# Altium schematic sheet Shield_Connectors.SchDoc: =SheetTitle_Top
size 420 x 297 mm; Author: G.Kasprowicz; CompanyName: WUT ISE; DrawnBy: G.Kasprowicz; Organization: WUT ISE; Address1: PW ISE; Address2: Nowowiejska 15/19 00-665 Warsaw; Address3: gkasprow@gmail.com; ModifiedBy: -; CheckedDate: -; Title2: SPEC-A7 / GPSDO connectors; DivGrp: WUT ISE; Designer: G.Kasprowicz; ModifiedDate: -; ProjectName: Sensor Box
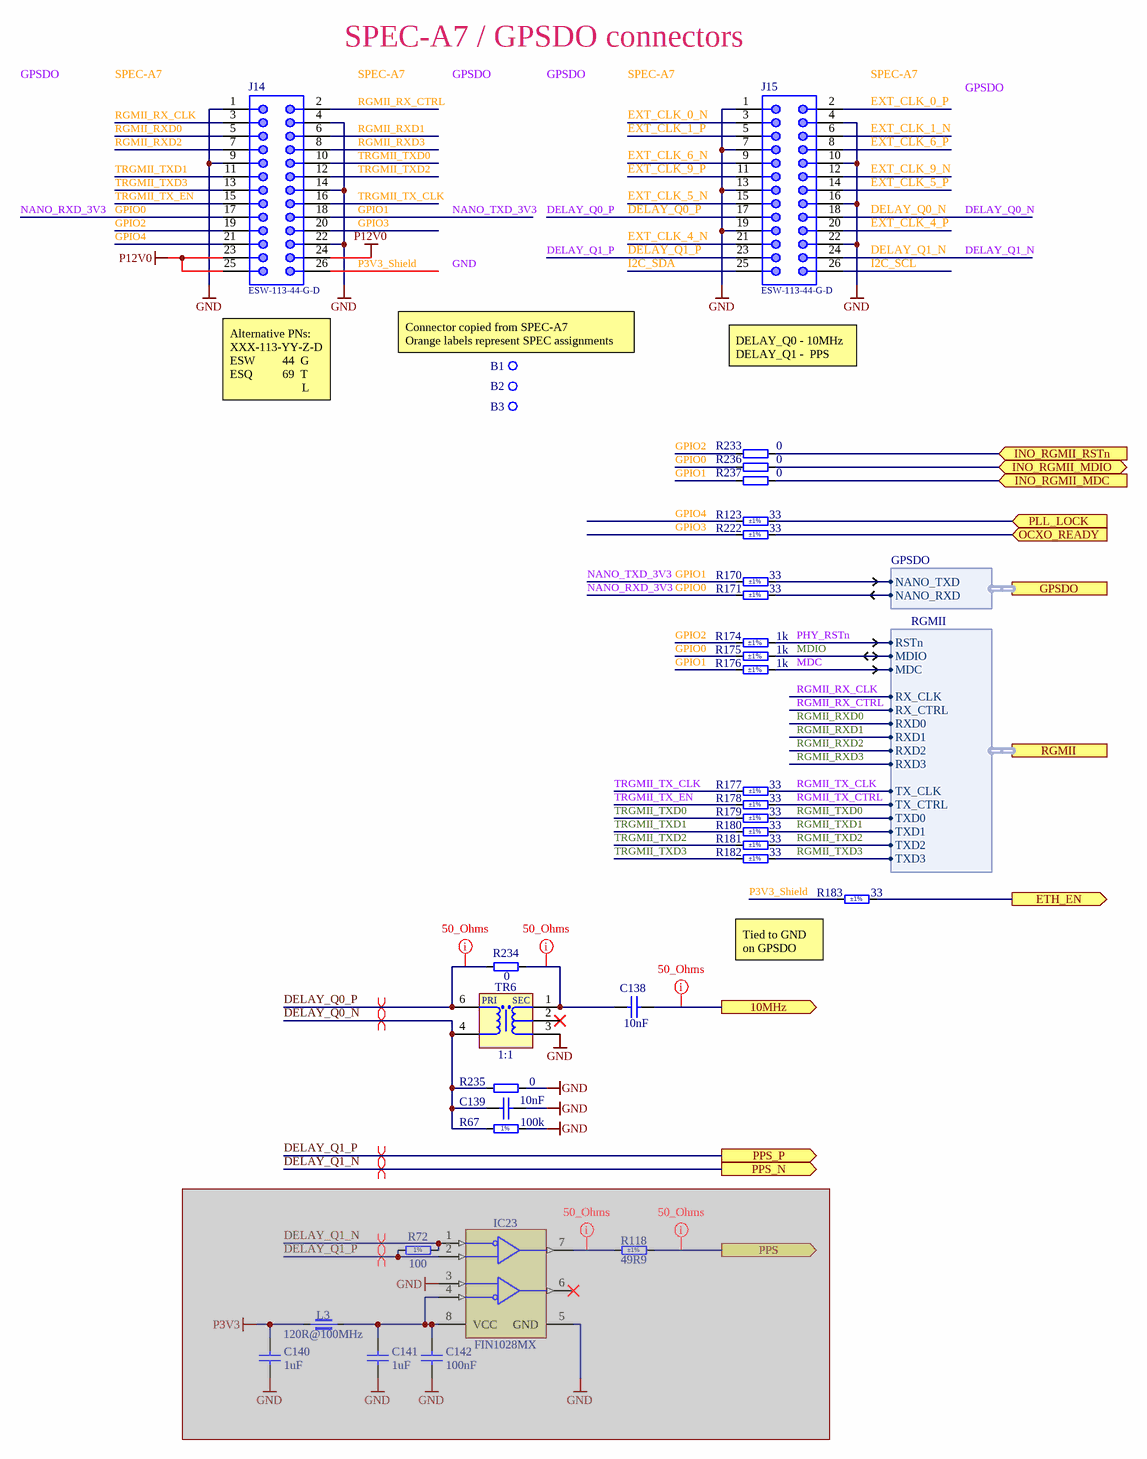
[diagram p0: Shield_Connectors.SchDoc]

## Parts
B1  Non Plated Hole  [MTG400]  (value not drawn)  (no BOM)
B2  Non Plated Hole  [MTG400]  (value not drawn)  (no BOM)
B3  Non Plated Hole  [MTG400]  (value not drawn)  (no BOM)
C138  10nF  [CAPC1005X55N]
C139  10nF  [CAPC1005X55N]
C140  1uF  [CAPC1608X87N]  (masked out: inside a compile mask, not in the netlist)
C141  1uF  [CAPC1608X87N]  (masked out: inside a compile mask, not in the netlist)
C142  100nF  [CAPC1005X55N]  (masked out: inside a compile mask, not in the netlist)
IC23  FIN1028MX  [SOIC127P600X175-8N]  (masked out: inside a compile mask, not in the netlist)
J14  ESW-113-44-G-D  [ESW-113-44-G-D]
J15  ESW-113-44-G-D  [ESW-113-44-G-D]
L3  120R@100MHz  [INDC1608X65N]  (masked out: inside a compile mask, not in the netlist)
R67  100k  [RESC1005X40N]
R72  100  [RESC1005X40N]  (masked out: inside a compile mask, not in the netlist)
R118  49R9  Tolerance: ±1%  [RESC1005X40N]  (masked out: inside a compile mask, not in the netlist)
R123  33  Tolerance: ±1%  [RESC1005X40N]
R170  33  Tolerance: ±1%  [RESC1005X40N]
R171  33  Tolerance: ±1%  [RESC1005X40N]
R174  1k  Tolerance: ±1%  [RESC1005X40N]
R175  1k  Tolerance: ±1%  [RESC1005X40N]
R176  1k  Tolerance: ±1%  [RESC1005X40N]
R177  33  Tolerance: ±1%  [RESC1005X40N]
R178  33  Tolerance: ±1%  [RESC1005X40N]
R179  33  Tolerance: ±1%  [RESC1005X40N]
R180  33  Tolerance: ±1%  [RESC1005X40N]
R181  33  Tolerance: ±1%  [RESC1005X40N]
R182  33  Tolerance: ±1%  [RESC1005X40N]
R183  33  Tolerance: ±1%  [RESC1005X40N]
R222  33  Tolerance: ±1%  [RESC1005X40N]
R233  0  [RESC1005X40N]
R234  0  [RESC1005X40N]
R235  0  [RESC1608X55N]
R236  0  [RESC1005X40N]
R237  0  [RESC1005X40N]
TR6  1:1  [XFMR_MINI-CIRCUITS_AT1521]

## Ports
10MHz (out), ETH_EN (out), GPSDO (harness GPSDO), INO_RGMII_MDC (in), INO_RGMII_MDIO (bidir), INO_RGMII_RSTn (in), OCXO_READY (in), PLL_LOCK (in), PPS (out), PPS_N (out), PPS_P (out), RGMII (harness RGMII)

## Harnesses
RGMII: RSTn, MDIO, MDC, RX_CLK, RX_CTRL, RXD0, RXD1, RXD2, RXD3, TXD0, TXD1, TXD2, TXD3, TX_CTRL, TX_CLK
GPSDO: NANO_RXD, NANO_TXD

## Nets
GND: C139.1 J14.1 J14.4 J14.9 J14.14 J14.22 J15.1 J15.4 J15.7 J15.10 J15.13 J15.16 J15.19 J15.22 R67.2 R235.1 TR6.3(S)
P12V0: J14.23 J14.24 J14.25
10MHz: C138.1 ; port 10MHz
DELAY_Q0_N: C139.2 J15.18 R67.1 R235.2 TR6.4(P)
DELAY_Q0_P: J15.17 R234.1 TR6.6(PDOT)
DELAY_Q1_N: J15.24 ; port PPS_N
DELAY_Q1_P: J15.23 ; port PPS_P
ETH_EN: R183.2 ; port ETH_EN
EXT_CLK_0_N: J15.3
EXT_CLK_0_P: J15.2
EXT_CLK_1_N: J15.6
EXT_CLK_1_P: J15.5
EXT_CLK_4_N: J15.21
EXT_CLK_4_P: J15.20
EXT_CLK_5_N: J15.15
EXT_CLK_5_P: J15.14
EXT_CLK_6_N: J15.9
EXT_CLK_6_P: J15.8
EXT_CLK_9_N: J15.12
EXT_CLK_9_P: J15.11
GPIO0: J14.17 R171.1 R175.1 R236.2
GPIO1: J14.18 R170.1 R176.1 R237.2
GPIO2: J14.19 R174.1 R233.2
GPIO3: J14.20 R222.1
GPIO4: J14.21 R123.1
I2C_SCL: J15.26
I2C_SDA: J15.25
INO_RGMII_MDC: R237.1 ; port INO_RGMII_MDC
INO_RGMII_MDIO: R236.1 ; port INO_RGMII_MDIO
INO_RGMII_RSTn: R233.1 ; port INO_RGMII_RSTn
MDC: R176.2 ; port RGMII.MDC
MDIO: R175.2 ; port RGMII.MDIO
OCXO_READY: R222.2 ; port OCXO_READY
P3V3_Shield: J14.26 R183.1
PHY_RSTn: R174.2 ; port RGMII.RSTn
PLL_LOCK: R123.2 ; port PLL_LOCK
RGMII_RX_CLK: J14.3 ; port RGMII.RX_CLK
RGMII_RX_CTRL: J14.2 ; port RGMII.RX_CTRL
RGMII_RXD0: J14.5 ; port RGMII.RXD0
RGMII_RXD1: J14.6 ; port RGMII.RXD1
RGMII_RXD2: J14.7 ; port RGMII.RXD2
RGMII_RXD3: J14.8 ; port RGMII.RXD3
RGMII_TX_CLK: R177.2 ; port RGMII.TX_CLK
RGMII_TX_CTRL: R178.2 ; port RGMII.TX_CTRL
RGMII_TXD0: R179.2 ; port RGMII.TXD0
RGMII_TXD1: R180.2 ; port RGMII.TXD1
RGMII_TXD2: R181.2 ; port RGMII.TXD2
RGMII_TXD3: R182.2 ; port RGMII.TXD3
TRGMII_TX_CLK: J14.16 R177.1
TRGMII_TX_EN: J14.15 R178.1
TRGMII_TXD0: J14.10 R179.1
TRGMII_TXD1: J14.11 R180.1
TRGMII_TXD2: J14.12 R181.1
TRGMII_TXD3: J14.13 R182.1
NetC138_2: C138.2 R234.2 TR6.1(SDOT)
NetR170_2: R170.2 ; port GPSDO.NANO_TXD
NetR171_2: R171.2 ; port GPSDO.NANO_RXD

Not connected (* = marked no-connect by the designer): B1 1; B2 1; B3 1; TR6 2(NC)*

## Layout directives
net class 50_Ohms: 10MHz, (no net found under the mark), DELAY_Q0_P, NetC138_2
differential pair: (no net found under the mark), DELAY_Q0_N, DELAY_Q0_P, DELAY_Q1_N, DELAY_Q1_P

## Notes on the sheet
- SPEC-A7 / GPSDO connectors
- GPSDO
- SPEC-A7
- NANO_RXD_3V3
- NANO_TXD_3V3
- DELAY_Q0_P
- DELAY_Q0_N
- GND
- DELAY_Q1_P
- DELAY_Q1_N
- (near B1) Connector copied from SPEC-A7
  Orange labels represent SPEC assignments
- DELAY_Q0 - 10MHz
  DELAY_Q1 -  PPS
- (near J14) Alternative PNs:
  XXX-113-YY-Z-D
  ESW         44  G
  ESQ          69  T
  L
- (near R183) Tied to GND on GPSDO
- Project/Equipment
- Document
- Designer
- Drawn by
- Check.by
- Copyright WUT ISE 2020.
  This documentation describes Open Hardware and is licensed under the CERN OHL v.1.2. You may redistribute and modify this documentation under the terms of the CERN OHL v.1.2. (http://ohwr.org/CERNOHL). This documentation is distributed WITHOUT ANY EXPRESS OR IMPLIED WARRANTY, INCLUDING OF MERCHANTABILITY, SATISFACTORY QUALITY AND FITNESS FOR A PARTICULAR PURPOSE. Please see the CERN OHL v.1.2 for applicable conditions.
- Contact
- File
- Last Mod.
- Print Date
- Sheet
- Size
- A3
- of
- Rev
- (in symbol R0402_100K_1%_0.0625W_100PPM) 1%
- (in symbol R0402_100R_1%_0.0625W_100PPM) 1%
- (in symbol XFMR_MINI-CIRCUITS_TC2-1TX+) PRI; SEC

## Library data of the parts
B1-B3 = NON-PLATED_HOLE4.0: Single Terminal Socket; Part Description: Non Plated Through Hole: Hole Dia.=4.0mm; Mounted: No; Part Number: NON-PLATED_HOLE4.0; Component Type: Standard (No BOM); Pin Count: 1; Family: Non Plated Hole; Socket: No; SMD: No; Sense: No; Status: None; ComponentHeight: 0mm; HelpURL: Undefined; Author: CERN DEM JMW; CreateDate: 22.03.2019; LatestRevisionDate: 22.03.2019; PackageDescription: Non Plated Through Hole: Hole Dia.=4.0mm
C138 C139 = CC0402_10NF_16V_10%_X7R: Non-polarised capacitor; Part Description: SMD Multilayer Chip Ceramic Capacitor; Manufacturer: GENERIC; Manufacturer1 Part Number: 223878715636; Voltage: 16V; TC: X7R; Tolerance: ±10%; Part Number: CC0402_10NF_16V_10%_X7R; Component Kind: Standard; Component Type: Standard; Pin Count: 2; Value: 10nF; Status: Not Recommended; Manufacturer Part Number: CC0402_10NF_16V_10%_X7R; Case: 0402; Mounted: Yes; Socket: No; SMD: Yes; Sense: No; Manufacturer1 Example: PHYCOMP; Manufacturer1 ComponentHeight: 0.55mm; HelpURL: \\cern.ch\dfs\Applications\Altium\Datasheets\CC0402_X7R_PHYCOMP.pdf; Author: CERN DEM JLC; CreateDate: 2007-12-03; LatestRevisionDate: 2007-12-03
C140 C141 = CC0603_1UF_25V_10%_X7R: Non-polarised capacitor; Part Description: SMD Multilayer Chip Ceramic Capacitor; Manufacturer: GENERIC; Manufacturer1 Part Number: GRM188R71E105KA12D; Voltage: 25V; TC: X7R; Tolerance: ±10%; Part Number: CC0603_1UF_25V_10%_X7R; Component Kind: Standard; Component Type: Standard; Pin Count: 2; Value: 1uF; Status: None; Manufacturer Part Number: CC0603_1UF_25V_10%_X7R; Case: 0603; Mounted: Yes; Socket: No; SMD: Yes; Sense: No; Manufacturer1 Example: MURATA; Manufacturer1 ComponentHeight: 0.9mm; HelpURL: \\cern.ch\dfs\Applications\Altium\Datasheets\CC0603_X7R_MURATA.pdf; Author: CERN DEM JLC; CreateDate: 18.01.2011; LatestRevisionDate: 18.01.2011
C142 = CC0402_100NF_16V_10%_X5R: Non-polarised capacitor; Part Description: SMD Multilayer Chip Ceramic Capacitor; Manufacturer: GENERIC; Manufacturer1 Part Number: GRM155R61C104KA88D; Voltage: 16V; TC: X5R; Tolerance: ±10%; Part Number: CC0402_100NF_16V_10%_X5R; Component Kind: Standard; Component Type: Standard; Pin Count: 2; Value: 100nF; Status: None; Manufacturer Part Number: CC0402_100NF_16V_10%_X5R; Case: 0402; Mounted: Yes; Socket: No; SMD: Yes; Sense: No; Manufacturer1 Example: MURATA; Manufacturer1 ComponentHeight: 0.55mm; HelpURL: \\cern.ch\dfs\Applications\Altium\Datasheets\CC0402_X5R_MURATA_GRM.pdf; Author: CERN DEM JLC; CreateDate: 10.12.2013; LatestRevisionDate: 10.12.2013
IC23 = IFC_FIN1028: 3.3V LVDS 2-Bit High-Speed Differential Reciever; Manufacturer: ON Semiconductor; PressFit: No; Bonding: No; Part Number: FIN1028MX; Component Kind: Standard; Component Type: Standard; Device: FIN1028MX; PackageDescription: SOIC 8, Pitch 1.27mm - Body 4x5mm, IPC Medium Density; Part Description: 3.3V LVDS 2-Bit High-Speed Differential Reciever; Manufacturer Part Number: FIN1028MX; Pin Count: 8; Case: SOIC8; Mounted: Yes; Socket: No; SMD: Yes; Sense: No; ComponentHeight: 0.8mm; Author: GK; HelpURL: \\cern.ch\dfs\Applications\Altium\Datasheets\FIN1101K8X.pdf; CreateDate: 08/11/2016; LatestRevisionDate: 08/11/2016
J14 J15 = ESW-113-44-G-D: ESW-113-44-G-D Pin Header, THT, pitch 2.54mm, Dual Row, Vertical, 26pin; Manufacturer: Samtec; Pin Number: 26; Part Number: ESW-113-44-G-D; Publisher: Samtec; Pitch: 2.54mm; Mounting Technology: THT; Manufacturer Part Number: ESW-113-44-G-D
L3 = IND0603_MURATA_BLM18SG121TN1D: Part Description: SMD EMIFIL Suppression Chip Ferrite Bead; Manufacturer: MURATA; Power: 3A; Resistance: 0.025R; Tolerance: ±25%; Part Number: IND0603_MURATA_BLM18SG121TN1D; Component Kind: Standard; Component Type: Standard; Pin Count: 2; Value: 120R@100MHz; Manufacturer Part Number: BLM18SG121TN1D; Case: 0603; Mounted: Yes; Socket: No; SMD: Yes; Sense: No; ComponentHeight: 0.65mm; HelpURL: \\cern.ch\dfs\Applications\Altium\Datasheets\IND0603_MURATA_BLM18S.pdf; Author: CERN DEM JLC; CreateDate: 23.07.2014; LatestRevisionDate: 25.10.2018
R67 = R0402_100K_1%_0.0625W_100PPM: Resistor - 1%; Part Description: General Purpose Thick Film Chip Resistor; Manufacturer: GENERIC; Manufacturer1 Part Number: 232270671004L; PressFit: No; TC: ±100ppm/°C; Part Number: R0402_100K_1%_0.0625W_100PPM; Component Kind: Standard; Component Type: Standard; Pin Count: 2; Value: 100k; Status: Not Recommended; Manufacturer Part Number: R0402_100K_1%_0.0625W_100PPM; Case: 0402; Mounted: Yes; Sense: No; Socket: No; SMD: Yes; Manufacturer1 Example: YAGEO PHYCOMP; Manufacturer1 ComponentHeight: 0.4mm; HelpURL: \\cern.ch\dfs\Applications\Altium\Datasheets\R0402_Phycomp_RC0402.pdf; Author: CERN DEM JLC; CreateDate: 03.12.2007; LatestRevisionDate: 17.10.2012; Power: 0.0625W; Tolerance: ±1%
R72 = R0402_100R_1%_0.0625W_100PPM: Resistor - 1%; Part Description: General Purpose Thick Film Chip Resistor; Manufacturer: GENERIC; Manufacturer1 Part Number: 232270671001L; TC: ±100ppm/°C; PressFit: No; Part Number: R0402_100R_1%_0.0625W_100PPM; Component Kind: Standard; Component Type: Standard; Pin Count: 2; Value: 100; Status: Not Recommended; Power: 0.0625W; Tolerance: ±1%; Manufacturer Part Number: R0402_100R_1%_0.0625W_100PPM; Case: 0402; Mounted: Yes; Sense: No; Socket: No; SMD: Yes; Manufacturer1 Example: YAGEO PHYCOMP; Manufacturer1 ComponentHeight: 0.4mm; HelpURL: \\cern.ch\dfs\Applications\Altium\Datasheets\R0402_Phycomp_RC0402.pdf; Author: CERN DEM JLC; CreateDate: 03.12.2007; LatestRevisionDate: 17.10.2012
R118 = R0402_49R9_1%_0.0625W_100PPM: Resistor - 1%; Part Description: General Purpose Thick Film Chip Resistor; Manufacturer: GENERIC; Manufacturer1 Part Number: 232270674999L or RC0402FR-0749R9L; TC: ±100ppm/°C; PressFit: No; Part Number: R0402_49R9_1%_0.0625W_100PPM; Component Kind: Standard; Component Type: Standard; Pin Count: 2; Value: 49R9; Status: Not Recommended; Power: 0.0625W; Manufacturer Part Number: R0402_49R9_1%_0.0625W_100PPM; Case: 0402; Mounted: Yes; Sense: No; Socket: No; SMD: Yes; Manufacturer1 Example: YAGEO PHYCOMP; Manufacturer1 ComponentHeight: 0.4mm; HelpURL: \\cern.ch\dfs\Applications\Altium\Datasheets\R0402_Phycomp_RC0402.pdf; Author: CERN DEM JLC; CreateDate: 24.10.2012; LatestRevisionDate: 24.10.2012
R123 R170 R171 R177-R183 R222 = R0402_33R_1%_0.0625W_100PPM: Resistor - 1%; Part Description: General Purpose Thick Film Chip Resistor; Manufacturer: GENERIC; Manufacturer1 Part Number: 232270673309L; TC: ±100ppm/°C; PressFit: No; Part Number: R0402_33R_1%_0.0625W_100PPM; Component Kind: Standard; Component Type: Standard; Pin Count: 2; Value: 33; Status: Not Recommended; Power: 0.0625W; Manufacturer Part Number: R0402_33R_1%_0.0625W_100PPM; Case: 0402; Mounted: Yes; Sense: No; Socket: No; SMD: Yes; Manufacturer1 Example: YAGEO PHYCOMP; Manufacturer1 ComponentHeight: 0.4mm; HelpURL: \\cern.ch\dfs\Applications\Altium\Datasheets\R0402_Phycomp_RC0402.pdf; Author: CERN DEM JLC; CreateDate: 03.12.2007; LatestRevisionDate: 17.10.2012
R174-R176 = R0402_1K_1%_0.0625W_100PPM: Resistor - 1%; Part Description: General Purpose Thick Film Chip Resistor; Manufacturer: GENERIC; Manufacturer1 Part Number: 232270671002L; TC: ±100ppm/°C; PressFit: No; Part Number: R0402_1K_1%_0.0625W_100PPM; Component Kind: Standard; Component Type: Standard; Pin Count: 2; Value: 1k; Status: Not Recommended; Power: 0.0625W; Manufacturer Part Number: R0402_1K_1%_0.0625W_100PPM; Case: 0402; Mounted: Yes; Sense: No; Socket: No; SMD: Yes; Manufacturer1 Example: YAGEO PHYCOMP; Manufacturer1 ComponentHeight: 0.4mm; HelpURL: \\cern.ch\dfs\Applications\Altium\Datasheets\R0402_Phycomp_RC0402.pdf; Author: CERN DEM JLC; CreateDate: 03.12.2007; LatestRevisionDate: 17.10.2012
R233 R234 R236 R237 = R0402_0R_JUMPER: Resistor; Part Description: 1A (0.05R Max DC Resistance) Zero Ohm Jumper; Manufacturer: GENERIC; Manufacturer1 Part Number: 232270591001L; Part Number: R0402_0R_JUMPER; Component Kind: Standard; Component Type: Standard; Pin Count: 2; Value: 0; Status: Not recommended; Manufacturer Part Number: R0402_0R_JUMPER; Case: 0402; Mounted: Yes; Sense: No; Socket: No; SMD: Yes; Manufacturer1 Example: YAGEO PHYCOMP; Manufacturer1 ComponentHeight: 0.4mm; HelpURL: \\cern.ch\dfs\Applications\Altium\Datasheets\R0402_Phycomp_RC0402.pdf; Author: CERN DEM JLC
  R233 R236 R237: CreateDate: 03.12.2007; LatestRevisionDate: 17.10.2012
  R234: CreateDate: 2007-12-03; LatestRevisionDate: 2012-10-17
R235 = R0603_0R_JUMPER: Resistor; Part Description: 1A (0.05R Max DC Resistance) Zero Ohm Jumper; Manufacturer: GENERIC; Manufacturer1 Part Number: NRC06Z0; PressFit: No; Part Number: R0603_0R_JUMPER; Component Kind: Standard; Component Type: Standard; Pin Count: 2; Value: 0; Status: Preferred; Manufacturer Part Number: R0603_0R_JUMPER; Case: 0603; Mounted: Yes; Sense: No; Socket: No; SMD: Yes; Manufacturer1 Example: NIC COMPONENT; Manufacturer1 ComponentHeight: 0.55mm; HelpURL: \\cern.ch\dfs\Applications\Altium\Datasheets\R0603_NIC_NRC.pdf; Author: CERN DEM JLC; CreateDate: 03.12.2007; LatestRevisionDate: 13.03.2008
TR6 = XFMR_MINI-CIRCUITS_TC2-1TX+: 50 Ohms 3 to 300MHz RF Transformer; Part Number: XFMR_MINI-CIRCUITS_TC2-1TX+; Component Kind: Standard; Component Type: Standard; Pin Count: 5; Value: 1:1; Status: None; Part Description: 50 Ohms 3 to 300MHz RF Transformer; Manufacturer: MINI-CIRCUITS; Manufacturer Part Number: TC2-1TX+; Mounted: Yes; Socket: No; Sense: No; SMD: Yes; ComponentHeight: 4.06mm; HelpURL: \\cern.ch\dfs\Applications\Altium\Datasheets\XFMR_MINI-CIRCUITS_TC2-1TX+.pdf; Author: CERN DEM MR; CreateDate: 18.10.2019; LatestRevisionDate: 18.10.2019